# EAGLE design ICM20602 (EAGLE 7.2.0)
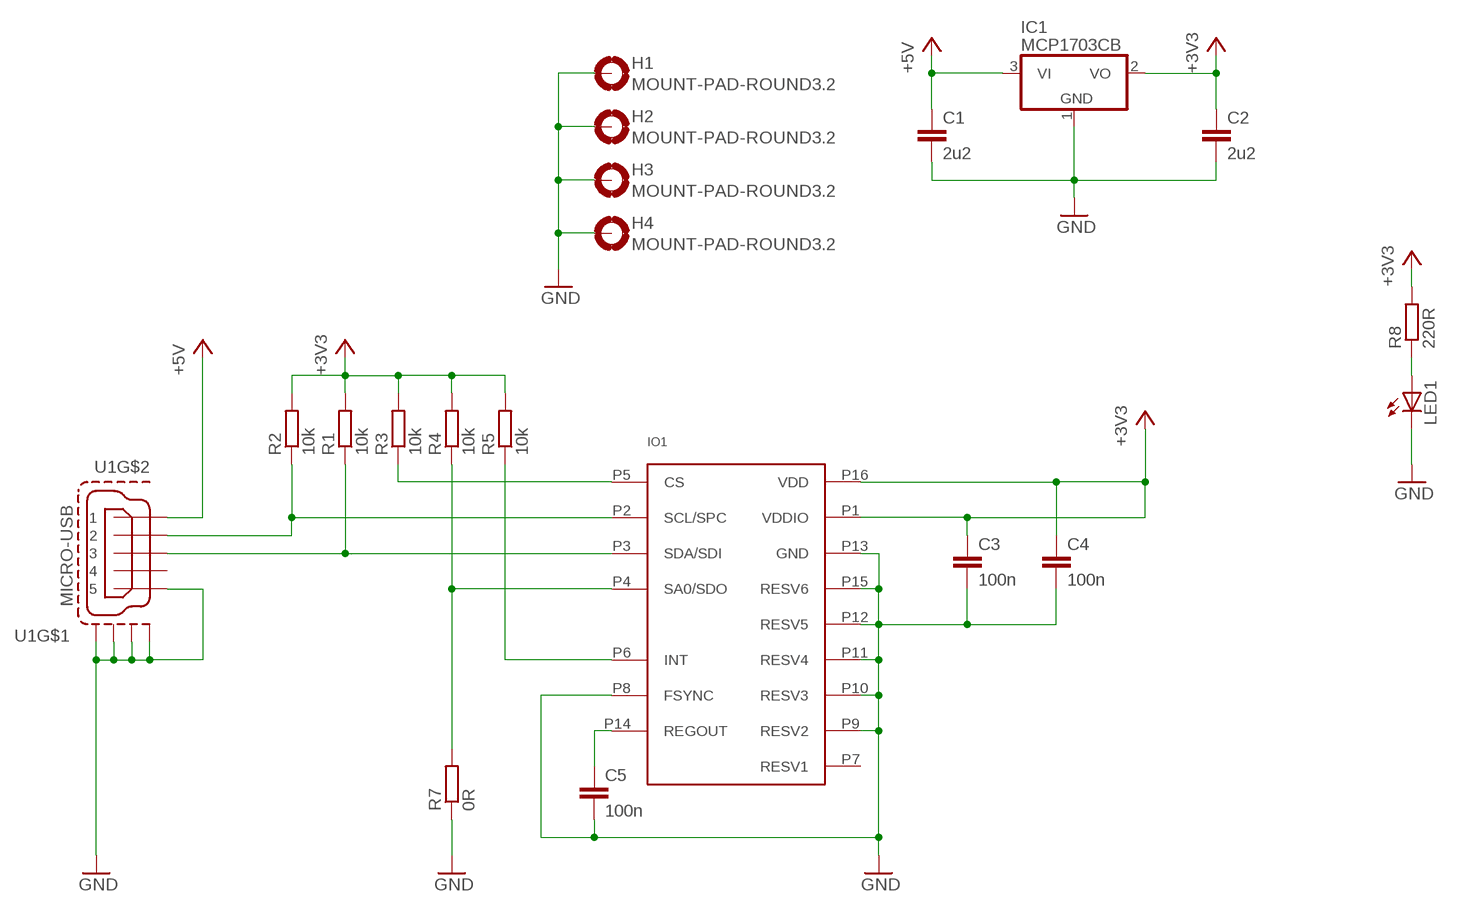
[diagram p0: schematic, sheet 1]

## Parts
C1  2u2  C-EUC0603  [C0603]
C2  2u2  C-EUC0603  [C0603]
C3  100n  C-EUC0603  [C0603]
C4  100n  C-EUC0603  [C0603]
C5  100n  C-EUC0603  [C0603]
H1  MOUNT-PAD-ROUND3.2  [3,2-PAD]
H2  MOUNT-PAD-ROUND3.2  [3,2-PAD]
H3  MOUNT-PAD-ROUND3.2  [3,2-PAD]
H4  MOUNT-PAD-ROUND3.2  [3,2-PAD]
IC1  MCP1703CB  [SOT23]
IO1  ICM20602  [LGA16]
LED1  LEDSML0603  [SML0603]
R1  10k  R-EU_R0603  [R0603]
R2  10k  R-EU_R0603  [R0603]
R3  10k  R-EU_R0603  [R0603]
R4  10k  R-EU_R0603  [R0603]
R5  10k  R-EU_R0603  [R0603]
R7  0R  R-EU_R0603  [R0603]
R8  220R  R-EU_R0603  [R0603]
U1  MICRO-USB  MICRO-USB-SHIELD-ZX62R-B-5P  [ZX62R-B-5P]

## Nets
+3V3: C2.1 C3.1 C4.1 IC1.2(VO) IO1.P1(VDDIO) IO1.P16(VDD) R1.2 R2.2 R3.2 R4.2 R5.2 R8.2
+5V: C1.1 IC1.3(VI) U1.1
GND: C1.2 C2.2 C3.2 C4.2 C5.2 H1.B3,2(MOUNT) H2.B3,2(MOUNT) H3.B3,2(MOUNT) H4.B3,2(MOUNT) IC1.1(GND) IO1.P8(FSYNC) IO1.P9(RESV2) IO1.P10(RESV3) IO1.P11(RESV4) IO1.P12(RESV5) IO1.P13(GND) IO1.P15(RESV6) LED1.C R7.1 U1.5 U1.M1(S1) U1.M2(S2) U1.M3(S3) U1.M4(S4)
N$1: IO1.P2(SCL/SPC) R2.1 U1.2
N$2: IO1.P3(SDA/SDI) R1.1 U1.3
N$3: C5.1 IO1.P14(REGOUT)
N$4: IO1.P5(CS) R3.1
N$5: IO1.P4(SA0/SDO) R4.1 R7.2
N$8: IO1.P6(INT) R5.1
N$9: LED1.A R8.1
Unconnected: IO1.P7(RESV1) U1.4

## Library data of the parts
C1-C5 = rcl:C-EU: CAPACITOR, European symbol
H1-H4 = holes:MOUNT-PAD-ROUND: MOUNTING PAD, round
IC1 = linear:MCP1703: 250 mA, 16V, Low Quiescent Current LDO Regulator Source: http://ww1.microchip.com/downloads/en/DeviceDoc/22049b.pdf
IO1 = gyro:ICM20602: ICM20602
LED1 = led:LED: LED OSRAM: - CHIPLED LG R971, LG N971, LY N971, LG Q971, LY Q971, LO R971, LY R971 LH N974, LH R974 LS Q976, LO Q976, LY Q976 LO Q996 - Hyper CHIPLED LW Q18S LB Q993, LB Q99A, LB R99A - SideLED LS A670, LO A670, LY A670, LG A670, LP A670 LB A673, LV A673, LT A673, LW A673 LH A674 LY A675 LS A676, LA A676, LO A676, LY A676, LW A676 LS A679, LY A679, LG A679 - Hyper Micro SIDELED® LS Y876, LA Y876, LO Y876, LY Y876 LT Y87S - SmartLED LW L88C, LW L88S LB L89C, LB L89S, LG L890 LS L89K, LO L89K, LY L89K LS L896, LA L896, LO L896, LY L896 - TOPLED LS T670, LO T670, LY T670, LG T670, LP T670 LSG T670, LSP T670, LSY T670, LOP T670, LYG T670 LG T671, LOG T671, LSG T671 LB T673, LV T673, LT T673, LW T673 LH T674 LS T676, LA T676, LO T676, LY T676, LB T676, LH T676, LSB T676, LW T676 LB T67C, LV T67C, LT T67C, LS T67K, LO T67K, LY T67K, LW E67C LS E67B, LA E67B, LO E67B, LY E67B, LB E67C, LV E67C, LT E67C LW T67C LS T679, LY T679, LG T679 LS T770, LO T770, LY T770, LG T770, LP T770 LB T773, LV T773, LT T773, LW T773 LH T774 LS E675, LA E675, LY E675, LS T675 LS T776, LA T776, LO T776, LY T776, LB T776 LHGB T686 LT T68C, LB T68C - Hyper Mini TOPLED® LB M676 - Mini TOPLED Santana® LG M470 LS M47K, LO M47K, LY M47K Source: http://www.osram.convergy.de LUXEON: - LUMILED® LXK2-PW12-R00, LXK2-PW12-S00, LXK2-PW14-U00, LXK2-PW14-V00 LXK2-PM12-R00, LXK2-PM12-S00, LXK2-PM14-U00 LXK2-PE12-Q00, LXK2-PE12-R00, LXK2-PE12-S00, LXK2-PE14-T00, LXK2-PE14-U00 LXK2-PB12-K00, LXK2-PB12-L00, LXK2-PB12-M00, LXK2-PB14-N00, LXK2-PB14-P00, LXK2-PB14-Q00 LXK2-PR12-L00, LXK2-PR12-M00, LXK2-PR14-Q00, LXK2-PR14-R00 LXK2-PD12-Q00, LXK2-PD12-R00, LXK2-PD12-S00 LXK2-PH12-R00, LXK2-PH12-S00 LXK2-PL12-P00, LXK2-PL12-Q00, LXK2-PL12-R00 Source: www.luxeon.com KINGBRIGHT: KA-3528ASYC Source: www.kingbright.com
R1-R5 R7 R8 = rcl:R-EU_: RESISTOR, European symbol
U1 = con-hirose:MICRO-USB-SHIELD-: Hirose Micro USB Connector ZX62R-B-5P: Micro B, reverse (top mount) shell SMT Supplier: DigiKey H11574CT-ND Source: http://www.hirose.co.jp/cataloge_hp/e24200011.pdf

## Board
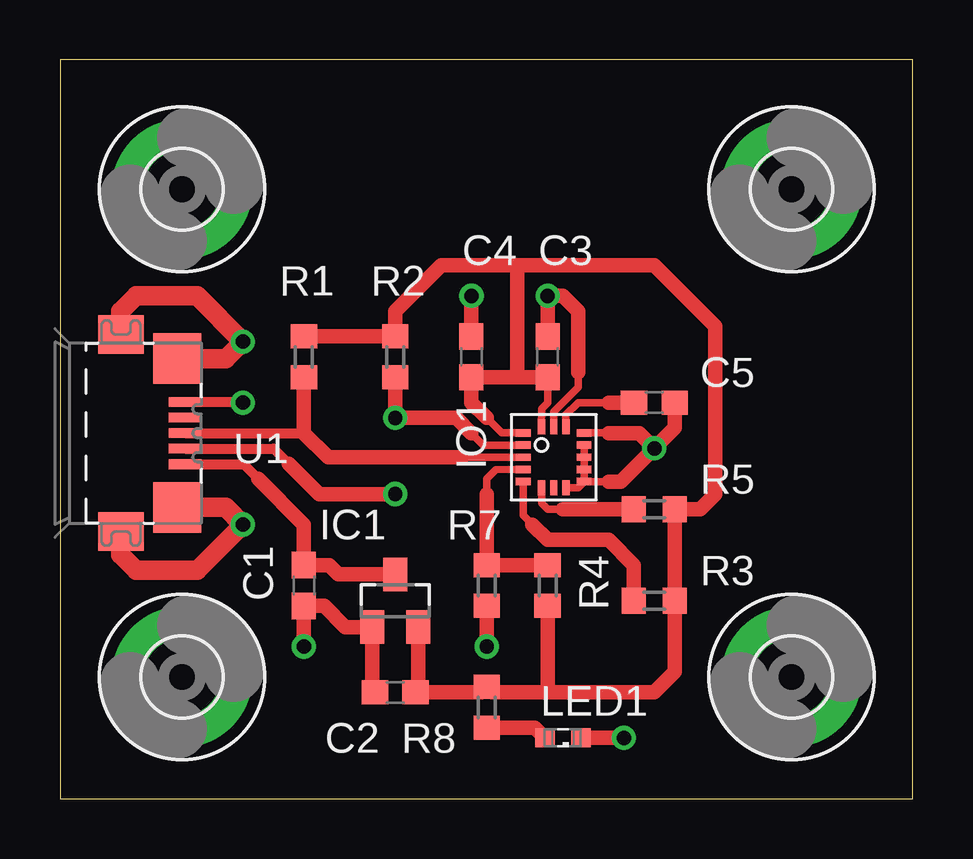
[diagram p1: board, top side]
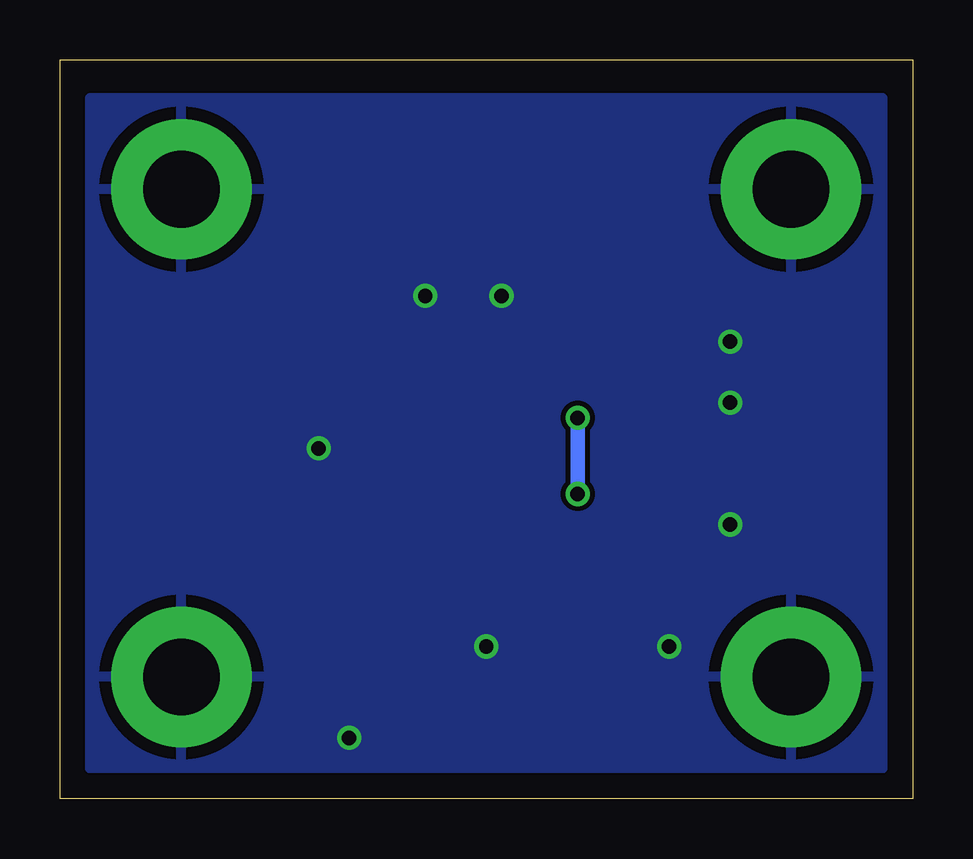
[diagram p2: board, bottom side, seen from below]

Size 35.54 x 30.79 mm. Coordinates in mm from the lower left corner, seen from the top.
Outline: 0,0 35.54,0 35.54,30.79 0,30.79 0,0
Copper layers (1*16): Top 0.035mm / dielectric 1.5mm / Bottom 0.035mm
Design rules "default *": minimum track width 10mil, minimum drill 24mil, track to track 8mil, track to pad 8mil, pad to pad 8mil, via to via 8mil, smd to smd 8mil, copper to edge 40mil, drill to drill 8mil, minimum pad ring 10mil, minimum via ring 8mil, stop-mask expansion 4mil, vias tented up to drill 0mil, thermal gap 20mil

### Footprints (pad centres in the part's own frame; a part is rotated, then mirrored left to right if it is on the bottom)
C0603 = smd 1.1 x 1: 1 -0.85,0; 2 0.85,0
3,2-PAD = drill 3.2 pad 5.842: B3,2 0,0
SOT23 = smd 1 x 1.4: 1 -0.95,-1.1; 2 0.95,-1.1; 3 0,1.1
LGA16 = smd 0.61 x 0.305: P1 -1.274,1.012; P2 -1.274,0.504; P3 -1.274,-0.004; P4 -1.274,-0.512; P5 -1.274,-1.02; P9 1.266,-1.02; P10 1.266,-0.512; P11 1.266,-0.004; P12 1.266,0.504; P13 1.266,1.012 | smd 0.305 x 0.61: P6 -0.512,-1.274; P7 -0.004,-1.274; P8 0.504,-1.274; P14 0.504,1.266; P15 -0.004,1.266; P16 -0.512,1.266
SML0603 = smd 0.8 x 0.8: A 0.75,0; C -0.75,0
R0603 = smd 1 x 1.1: 1 -0.85,0; 2 0.85,0
ZX62R-B-5P = smd 1.35 x 0.4: 1 2.675,-1.3; 2 2.675,-0.65; 3 2.675,0; 4 2.675,0.65; 5 2.675,1.3 | smd 1.9 x 1.6: M1 0,-4.1; M2 0,4.1 | smd 2 x 2.1: M3 2.35,3.1; M4 2.35,-3.1

### Placement (x,y rotation side)
C1  10.16,8.89 270 top
C2  13.97,4.45 180 top
C3  20.32,18.41 90 top
C4  17.14,18.41 90 top
C5  24.77,16.51 0 top
H1  5.08,25.4 0 top
H2  30.48,25.4 0 top
H3  30.48,5.08 0 top
H4  5.08,5.08 0 top
IC1  13.97,8.26 0 top
IO1  20.57,14.24 0 top
LED1  20.95,2.54 180 top
R1  10.16,18.41 90 top
R2  13.97,18.41 90 top
R3  24.77,8.26 0 top
R4  20.32,8.89 270 top
R5  24.77,12.06 0 top
R7  17.78,8.89 90 top
R8  17.78,3.81 90 top
U1  2.54,15.24 0 top

### Tracks (layer width: path | path; a pad name or v marks a point on that pad's centre or on a via)
+3V3
  Top 0.305: IO1.P16 20.07,16.26 20.32,16.51 C3.1 | IO1.P1 18.41,15.25 17.78,15.88
  Top 0.61: 19.05,22.23 24.77,22.23 27.3,19.68 27.3,12.7 26.67,12.06 R5.2 R3.2 25.61,5.29 24.77,4.45 20.32,4.45 | 19.05,22.23 15.88,22.23 13.97,20.32 R2.2 R1.2 | 19.05,17.57 19.05,22.23 | C3.1 19.05,17.57 | 19.05,17.57 C4.1 17.14,16.51 17.78,15.88 | R4.2 20.32,4.45 | IC1.2 14.92,4.54 C2.1 17.57,4.45 R8.2 18,4.45 20.32,4.45
+5V
  Top 0.406: U1.1 7.65,13.94 8.26,13.34
  Top 0.61: IC1.3 11.6,9.36 11.21,9.74 C1.1 10.16,11.43 8.26,13.34
GND  (via drill 0.6)
  Top 0.305: 21.59,17.78 21.59,17.14 20.57,16.12 IO1.P15 | IO1.P8 21.59,12.95 IO1.P9 | IO1.P9 IO1.P10 IO1.P11 IO1.P12 | IO1.P9 22.85,13.22 22.86,13.21 | IO1.P13 22.85,15.25 22.86,15.24
  Top 0.406: U1.5 7.59,16.54 v7.62,16.51
  Top 0.61: C2.2 13.02,4.54 IC1.1 11.89,7.16 11.01,8.04 C1.2 v10.16,6.35 | R7.1 v17.78,6.35 | LED1.C v23.5,2.54 | C4.2 v17.14,20.95 | C3.2 v20.32,20.95 20.95,20.95 21.59,20.32 21.59,17.78 | C5.2 25.61,15.46 v24.77,14.61 | v24.77,14.61 24.13,15.24 22.86,15.24 | v24.77,14.61 23.37,13.21 22.86,13.21
  Top 0.813: U1.M3 6.91,18.34 v7.62,19.05 5.71,20.95 3.17,20.95 2.54,20.32 U1.M2 | U1.M1 2.54,10.16 3.17,9.53 5.71,9.53 v7.62,11.43 6.91,12.14 U1.M4
  pour Bottom: 1.27,29.21 1.27,1.27 34.29,1.27 34.29,29.21
N$1  (via drill 0.6)
  Top 0.305: IO1.P2 17.64,14.74 17.14,15.24
  Top 0.406: U1.2 8.9,14.59 9.53,13.97
  Top 0.61: R2.1 v13.97,15.88 16.51,15.88 17.14,15.24 | v13.97,12.7 10.79,12.7 9.53,13.97
  Bottom 0.61: v13.97,12.7 v13.97,15.88
N$2
  Top 0.305: IO1.P3 16.76,14.22
  Top 0.406: U1.3 10.16,15.24
  Top 0.61: 16.76,14.22 11.18,14.22 10.16,15.24 R1.1
N$3
  Top 0.305: IO1.P14 21.08,16 21.59,16.51 22.86,16.51
  Top 0.61: C5.1 22.86,16.51
N$4
  Top 0.305: IO1.P5 19.3,11.81 19.68,11.43
  Top 0.61: 19.68,11.43 20.32,10.79 22.86,10.79 23.91,9.74 R3.1
N$5
  Top 0.305: IO1.P4 18.16,13.72 17.78,13.34 17.78,12.7
  Top 0.61: R4.1 R7.2 17.78,12.7
N$8
  Top 0.305: 20.95,12.06 20.32,12.06 20.07,12.32 IO1.P6
  Top 0.61: 20.95,12.06 R5.1
N$9
  Top 0.61: R8.1 19.79,2.96 LED1.A